# Altium schematic sheet dspinterface.SchDoc
size A
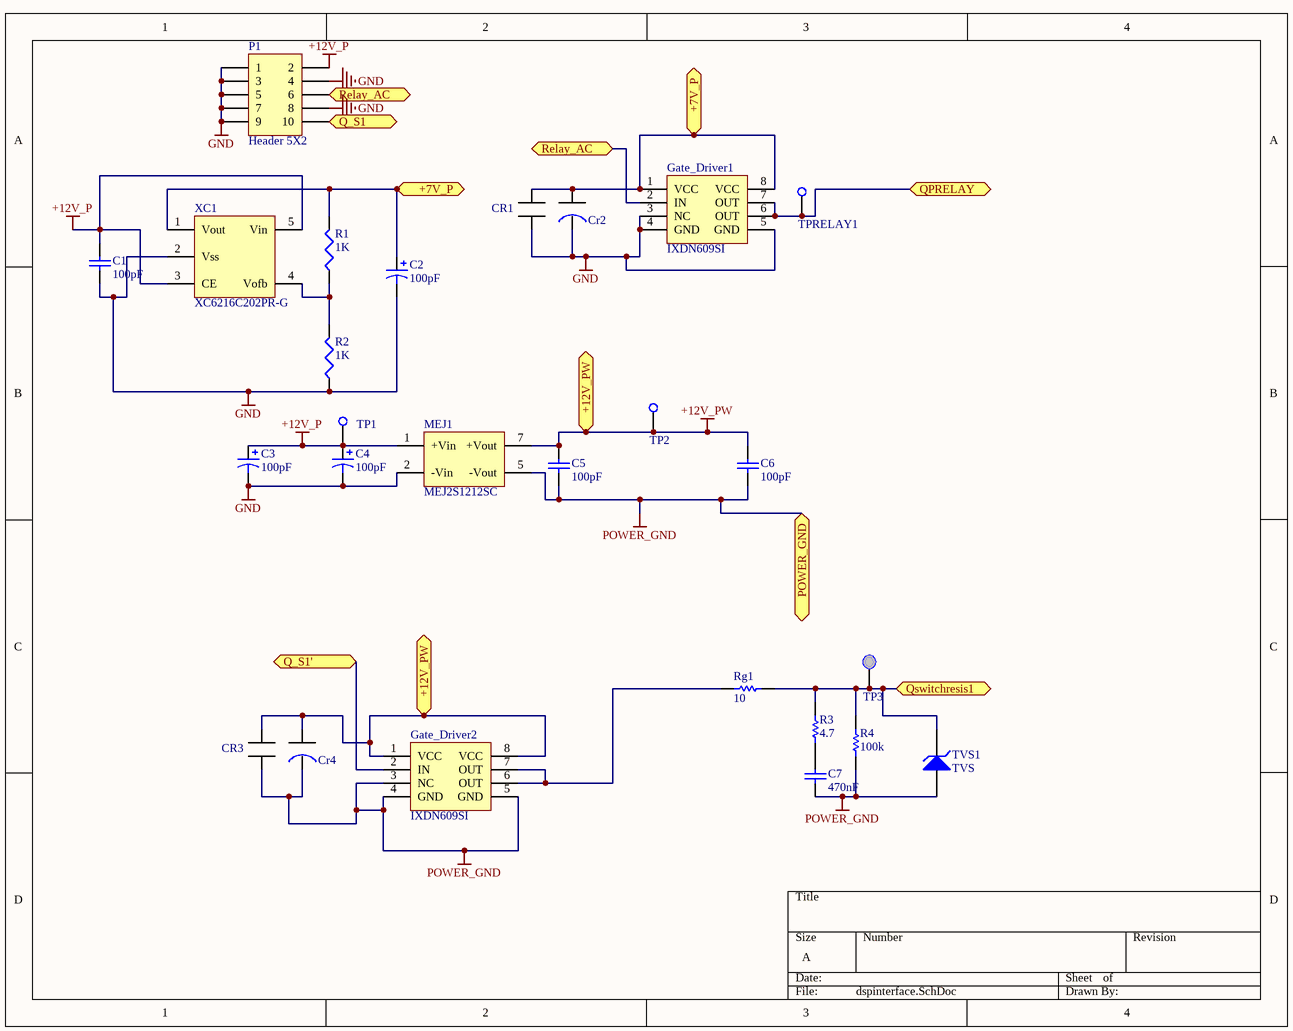
[diagram p0: dspinterface.SchDoc]

## Parts
C1  value 100pF  [C1206]  (hidden comment: Cap Semi)
C2  value 100pF  [C0805]  (hidden comment: Cap Pol3)
C3  value 100pF  [C0805]  (hidden comment: Cap Pol3)
C4  value 100pF  [C0805]  (hidden comment: Cap Pol3)
C5  value 100pF  [C1206]  (hidden comment: Cap Semi)
C6  value 100pF  [C1206]  (hidden comment: Cap Semi)
C7  value 470nF  [Capacitor 0805]  (hidden comment: Cap)
CR1  100nF  [Cap_SMD]  (value not drawn)
Cr2  22uF  [Cap_tantalum]  (value not drawn)
CR3  100nF  [Cap_SMD]  (value not drawn)
Cr4  22uF  [Cap_tantalum]  (value not drawn)
Gate_Driver1  IXDN609SI  [Gate driver _low side]
Gate_Driver2  IXDN609SI  [Gate driver _low side]
MEJ1  MEJ2S1212SC  [MEJ2]
P1  Header 5X2  [HDR2X5]
R1  value 1K  [0805 RES]  (hidden comment: Res3)
R2  value 1K  [0805 RES]  (hidden comment: Res3)
R3  value 4.7  [0805 RES]  (hidden comment: Res1-Metal Oxid Film)
R4  value 100k  [0805 RES]  (hidden comment: Res1-Metal Oxid Film)
Rg1  value 10  [0805 RES]  (hidden comment: Res1-Metal Oxid Film)
TP1  Test Point  [Test Point]  (value not drawn)
TP2  Test Point  [Test Point]  (value not drawn)
TP3  Test point  [Test Point]  (value not drawn)
TPRELAY1  Test Point  [Test Point]  (value not drawn)
TVS1  TVS  [TVS]
XC1  XC6216C202PR-G  [SOT-89-5]

## Ports
+7V_P (bidir), +12V_PW (bidir), POWER_GND (bidir), Q_S1, Q_S1', QPRELAY (bidir), Qswitchresis1 (bidir), Relay_AC (bidir)

## Nets
+12V_P: C1.2 C3.1 C4.1 MEJ1.1(+Vin) P1.2 TP1.1(TP?) XC1.3(CE) XC1.5(Vin)
+12V_PW: C5.2 C6.2 CR3.1 Cr4.1 Gate_Driver2.1(VCC) Gate_Driver2.8(VCC) MEJ1.7(+Vout) TP2.1(TP?) ; port +12V_PW
GND: C1.1 C2.2 C3.2 C4.2 CR1.2 Cr2.2 Gate_Driver1.3(NC) Gate_Driver1.4(GND) Gate_Driver1.5(GND) MEJ1.2(-Vin) P1.1 P1.3 P1.4 P1.5 P1.7 P1.8 P1.9 R2.1 XC1.2(Vss)
POWER_GND: C5.1 C6.1 C7.1 CR3.2 Cr4.2 Gate_Driver2.3(NC) Gate_Driver2.4(GND) Gate_Driver2.5(GND) MEJ1.5(-Vout) R4.1 TVS1.1(A) ; port POWER_GND
+7V_P: C2.1 CR1.1 Cr2.1 Gate_Driver1.1(VCC) Gate_Driver1.8(VCC) R1.2 XC1.1(Vout) ; port +7V_P
Q_S1: P1.10 ; port Q_S1
Q_S1': Gate_Driver2.2(IN) ; port Q_S1'
QPRELAY: Gate_Driver1.6(OUT) Gate_Driver1.7(OUT) TPRELAY1.1(TP?) ; port QPRELAY
Qswitchresis1: R3.2 R4.2 Rg1.2 TP3.1 TVS1.2(K) ; port Qswitchresis1
Relay_AC: Gate_Driver1.2(IN) P1.6 ; port Relay_AC
NetC7_2: C7.2 R3.1
NetGate_Driver2_6: Gate_Driver2.6(OUT) Gate_Driver2.7(OUT) Rg1.1
NetR1_1: R1.1 R2.2 XC1.4(Vofb)

## Library data of the parts
C1 C5 C6 = Cap Semi: Capacitor (Semiconductor SIM Model); Published: 8-Jun-2000; LatestRevisionDate: 29-May-2009; LatestRevisionNote: IPC-7351 Footprint Added.; PackageReference: C1206; Publisher: Altium Limited; PackageDescription: Chip Capacitor
C2-C4 = Cap Pol3: Polarized Capacitor (Surface Mount); Published: 8-Jun-2000; LatestRevisionDate: 29-May-2009; LatestRevisionNote: IPC-7351 Footprint Added.; PackageReference: C0805; Publisher: Altium Limited; PackageDescription: Chip Capacitor
C7 = Cap: Capacitor; Published: 8-Jun-2000; LatestRevisionDate: 17-Jul-2002; LatestRevisionNote: Re-released for DXP Platform.; PackageReference: RAD-0.3; Publisher: Altium Limited
CR1 CR3 = Cap_SMD
Cr2 Cr4 = Cap_tantalum
Gate_Driver1 Gate_Driver2 = Gate driver low side
MEJ1 = Power supply2
P1 = Header 5X2: Header, 5-Pin, Dual row; LatestRevisionDate: 17-Jul-2002; LatestRevisionNote: Re-released for DXP Platform.; Publisher: Altium Limited
R1 R2 = Res3: Resistor; Published: 8-Jun-2000; LatestRevisionDate: 29-May-2009; LatestRevisionNote: IPC-7351 Footprint Added.; PackageReference: J1-0603; Publisher: Altium Limited; PackageDescription: Chip Resistor
R3 R4 Rg1 = Res1: Resistor; Published: 8-Jun-2000; LatestRevisionDate: 17-Jul-2002; LatestRevisionNote: Re-released for DXP Platform.; PackageReference: AXIAL-0.3; Publisher: Altium Limited
XC1 = power supply